# Altium schematic sheet Transmitter.SchDoc: Transmitter
size A4; Author: Andreas Rehn; CompanyName: Hochschule Ulm; Engineer: Andreas Rehn; Organization: Hochschule Ulm; Address1: Institut für Medizintechnik; Address2: und Mechatronik; Address3: Albert-Einstein-Allee 55; Address4: 89081 Ulm; SheetNumber: 6; SheetTotal: 11; ProjectName: Ultrasound Doppler 2015
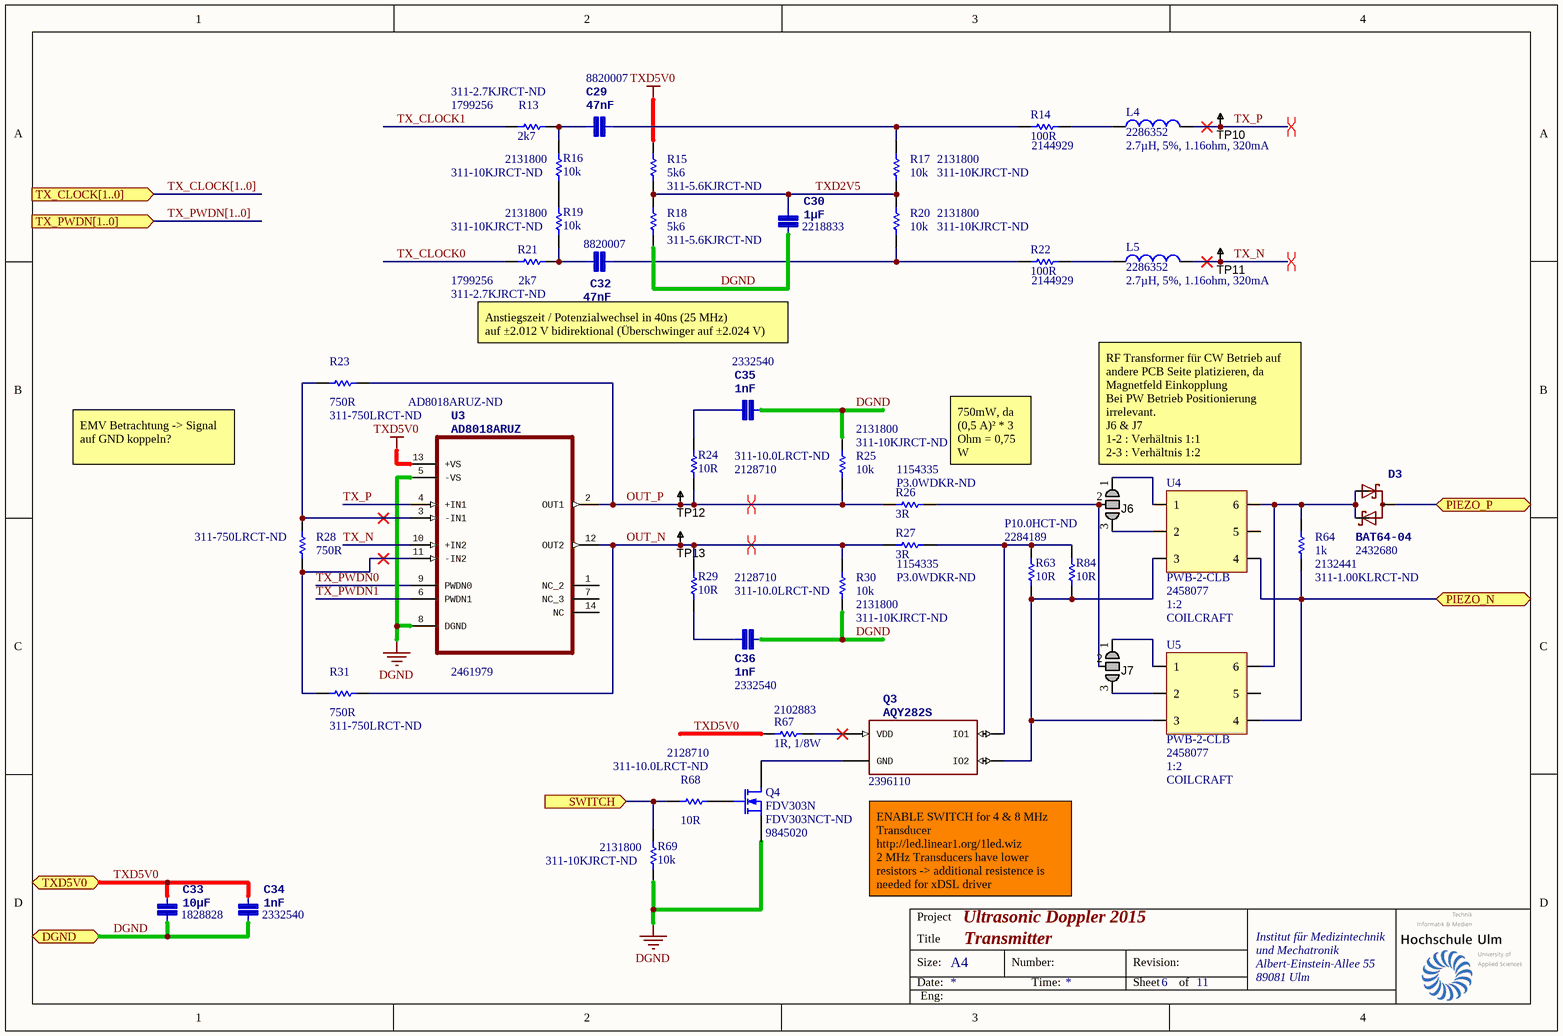
[diagram p0: Transmitter.SchDoc]

## Parts
C29  47nF  Supplier Part Number 1: 8820007  [0603[1508]]
C30  1µF  Supplier Part Number 1: 2218833  [0402[1005]]
C32  47nF  Supplier Part Number 1: 8820007  [0603[1508]]
C33  10µF  Supplier Part Number 1: 1828828  [0805[2012]]
C34  1nF  Supplier Part Number 1: 2332540  [0402[1005]]
C35  1nF  Supplier Part Number 1: 2332540  [0402[1005]]
C36  1nF  Supplier Part Number 1: 2332540  [0402[1005]]
D3  BAT64-04  Supplier Part Number 1: 2432680  [SOT23-3]
J6  Jumper  [Jump_3Way]  (value not drawn)  (no BOM)
J7  Jumper  [Jump_3Way]  (value not drawn)  (no BOM)
L4  2.7µH, 5%, 1.16ohm, 320mA  Supplier Part Number 1: 2286352  [WE0805]
L5  2.7µH, 5%, 1.16ohm, 320mA  Supplier Part Number 1: 2286352  [WE0805]
Q3  AQY282S  Supplier Part Number 1: 2396110  [SOP4]
Q4  FDV303N  Supplier Part Number 1: FDV303NCT-ND  Supplier Part Number 2: 9845020  [SOT23127P600-8N]
R13  2k7  Supplier Part Number 1: 311-2.7KJRCT-ND  Supplier Part Number 2: 1799256  [0402[1005]]
R14  100R  Supplier Part Number 1: 2144929  [0402[1005]]
R15  5k6  Supplier Part Number 1: 311-5.6KJRCT-ND  [0402[1005]]
R16  10k  Supplier Part Number 1: 311-10KJRCT-ND  Supplier Part Number 2: 2131800  [0402[1005]]
R17  10k  Supplier Part Number 1: 311-10KJRCT-ND  Supplier Part Number 2: 2131800  [0402[1005]]
R18  5k6  Supplier Part Number 1: 311-5.6KJRCT-ND  [0402[1005]]
R19  10k  Supplier Part Number 1: 311-10KJRCT-ND  Supplier Part Number 2: 2131800  [0402[1005]]
R20  10k  Supplier Part Number 1: 311-10KJRCT-ND  Supplier Part Number 2: 2131800  [0402[1005]]
R21  2k7  Supplier Part Number 1: 311-2.7KJRCT-ND  Supplier Part Number 2: 1799256  [0402[1005]]
R22  100R  Supplier Part Number 1: 2144929  [0402[1005]]
R23  750R  Supplier Part Number 1: 311-750LRCT-ND  [0402[1005]]
R24  10R  Supplier Part Number 1: 311-10.0LRCT-ND  Supplier Part Number 2: 2128710  [0402[1005]]
R25  10k  Supplier Part Number 1: 311-10KJRCT-ND  Supplier Part Number 2: 2131800  [0402[1005]]
R26  3R  Supplier Part Number 1: P3.0WDKR-ND  Supplier Part Number 2: 1154335  [2010[5.0x2.5 metric]]
R27  3R  Supplier Part Number 1: P3.0WDKR-ND  Supplier Part Number 2: 1154335  [2010[5.0x2.5 metric]]
R28  750R  Supplier Part Number 1: 311-750LRCT-ND  [0402[1005]]
R29  10R  Supplier Part Number 1: 311-10.0LRCT-ND  Supplier Part Number 2: 2128710  [0402[1005]]
R30  10k  Supplier Part Number 1: 311-10KJRCT-ND  Supplier Part Number 2: 2131800  [0402[1005]]
R31  750R  Supplier Part Number 1: 311-750LRCT-ND  [0402[1005]]
R63  10R  Supplier Part Number 1: 2284189  Supplier Part Number 2: P10.0HCT-ND  [0603[1508]]
R64  1k  Supplier Part Number 1: 311-1.00KLRCT-ND  Supplier Part Number 2: 2132441  [0402[1005]]
R67  1R, 1/8W  Supplier Part Number 1: 2102883  [RES1405[3614 Metric]]
R68  10R  Supplier Part Number 1: 311-10.0LRCT-ND  Supplier Part Number 2: 2128710  [0402[1005]]
R69  10k  Supplier Part Number 1: 311-10KJRCT-ND  Supplier Part Number 2: 2131800  [0402[1005]]
R84  10R  [0603[1508]]
TP10  TESTPOINT_THT_MINI  [TP-THT-MINI]  (value not drawn)
TP11  TESTPOINT_THT_MINI  [TP-THT-MINI]  (value not drawn)
TP12  TESTPOINT_THT_MINI  [TP-THT-MINI]  (value not drawn)
TP13  TESTPOINT_THT_MINI  [TP-THT-MINI]  (value not drawn)
U3  AD8018ARUZ  Supplier Part Number 1: 2461979  Supplier Part Number 2: AD8018ARUZ-ND  [TSSOP14]
U4  PWB-2-CLB  Supplier Part Number 1: 2458077  Impedance ratio: 1:2  Manufactor: COILCRAFT  [PWB-X-]
U5  PWB-2-CLB  Supplier Part Number 1: 2458077  Impedance ratio: 1:2  Manufactor: COILCRAFT  [PWB-X-]

## Ports
DGND, PIEZO_N, PIEZO_P, SWITCH (in), TX_CLOCK[1..0] (in), TX_PWDN[1..0] (in), TXD5V0

## Nets
DGND: C30.2(P$2) C33.2(P$2) C34.2(P$2) C35.1(P$1) C36.1(P$1) Q4.3(S) R18.2 R25.2 R30.2 R69.1 U3.5(-VS) U3.8(DGND) ; port DGND
TXD5V0: C33.1(P$1) C34.1(P$1) R15.1 R67.1 U3.13(+VS) ; port TXD5V0
OUT_N: R27.1 R29.1 R30.1 R31.2 TP13.1 U3.12(OUT2)
OUT_P: R23.2 R24.2 R25.1 R26.1 TP12.1 U3.2(OUT1)
PIEZO_N: R64.2 U4.4 U5.4 ; port PIEZO_N
PIEZO_P: D3.3(C1A2) ; port PIEZO_P
SWITCH: R68.1 R69.2 ; port SWITCH
TX_CLOCK0: R21.1
TX_CLOCK1: R13.1
TX_N: L5.2 TP11.1 U3.10(+IN2)
TX_P: L4.2 TP10.1 U3.4(+IN1)
TX_PWDN0: U3.9(PWDN0)
TX_PWDN1: U3.6(PWDN1)
TXD2V5: C30.1(P$1) R15.2 R17.2 R18.1 R20.1
NetC29_1: C29.1(P$1) R14.1 R17.1
NetC29_2: C29.2(P$2) R13.2 R16.1
NetC32_1: C32.1(P$1) R20.2 R22.1
NetC32_2: C32.2(P$2) R19.2 R21.2
NetC35_2: C35.2(P$2) R24.1
NetC36_2: C36.2(P$2) R29.2
NetD3_1: D3.1(A1) D3.2(C2) R64.1 U4.6 U5.6
NetJ6_1: J6.1 U4.1
NetJ6_2: J6.2 J7.2 R26.2
NetJ6_3: J6.3 U4.2
NetJ7_1: J7.1 U5.1
NetJ7_3: J7.3 U5.2
NetL4_1: L4.1 R14.2
NetL5_1: L5.1 R22.2
NetQ3_1: Q3.1(VDD) R67.2
NetQ3_2: Q3.2(GND) Q4.1(D)
NetQ3_3: Q3.3(IO2) R63.1 R84.1 U4.3 U5.3
NetQ3_4: Q3.4(IO1) R27.2 R63.2 R84.2
NetQ4_2: Q4.2(G) R68.2
NetR16_2: R16.2 R19.1
NetR23_1: R23.1 R28.1 U3.3(-IN1)
NetR28_2: R28.2 R31.1 U3.11(-IN2)

Not connected (* = marked no-connect by the designer): U3 1(NC_2) 7(NC_3) 14(NC); U4 5; U5 5

## Buses and harness runs
bus TX_CLOCK[1..0] = port TX_CLOCK[1..0]
bus TX_PWDN[1..0] = port TX_PWDN[1..0]

## Layout directives
differential pair: OUT_N, OUT_P, TX_N, TX_P

## Notes on the sheet
- Anstiegszeit / Potenzialwechsel in 40ns (25 MHz)
  auf ±2.012 V bidirektional (Überschwinger auf ±2.024 V)
- EMV Betrachtung -> Signal auf GND koppeln?
- (near R26) 750mW, da (0,5 A)² * 3 Ohm = 0,75 W
- RF Transformer für CW Betrieb auf andere PCB Seite platizieren, da Magnetfeld Einkopplung
  Bei PW Betrieb Positionierung irrelevant.
  J6 & J7
  1-2 : Verhältnis 1:1
  2-3 : Verhältnis 1:2
- (near Q3) ENABLE SWITCH for 4 & 8 MHz Transducer
  http://led.linear1.org/1led.wiz
  2 MHz Transducers have lower resistors -> additional resistence is needed for xDSL driver
- Project
- Ultrasonic Doppler 2015
- Title
- Size:
- Date:
- A4
- Number:
- Time:
- Revision:
- Sheet
- of
- Eng:

## Library data of the parts
C29 C30 C32-C36 = Capacitor: Cap; Supplier 1: Farnell
  C29 C32: value: 47nF
  C30: value: 1µF
  C33: value: 10µF
  C34-C36: value: 1nF
D3 = BAT64-04: Silicon Schottky Diodes; value: BAT64-04; Supplier 1: Farnell
J6 J7 = JUMP_3WAY: SMD jumper
L4 L5 = Inductor: Ferrit; Code_IEC: 1005; Published: 8-Jun-2000; LatestRevisionDate: 29-May-2009; LatestRevisionNote: IPC-7351 Footprint Added.; PackageReference: 0402-A; Publisher: Altium Limited; PackageDescription: Chip Inductor; Code_JEITA: 0402; Value: 2.7µH, 5%, 1.16ohm, 320mA; Supplier 1: Farnell
Q3 = AQY282S: PhotoMOS RELAY 0.5A, 60V; value: AQY282S; ComponentLink1URL: http://www.farnell.com/datasheets/1486501.pdf; Supplier 1: Farnell; ComponentLink1Description: Datasheet
Q4 = MOSFET-N: N-Channel MOSFET; Published: 8-Jun-2000; LatestRevisionDate: 17-Jul-2002; LatestRevisionNote: Re-released for DXP Platform.; PackageVersion: 1995/1996; PackageReference: E3; Publisher: Altium Limited; PackageDescription: TO, Flat Index; 3 In-Line, Axial Leads; Body Dia. 4.6mm; Lead Dia. 0.5 mm (max); Supplier 1: Digi-Key; Supplier 2: Farnell; value: FDV303N; ComponentLink1URL: https://www.fairchildsemi.com/datasheets/FD/FDV303N.pdf; ComponentLink1Description: DataSheet
R13-R31 R63 R64 R67-R69 R84 = Resistor: Published: 8-Jun-2000; LatestRevisionDate: 17-Jul-2002; LatestRevisionNote: Re-released for DXP Platform.; Publisher: Altium Limited; PackageDescription: Axial Device, Thru-Hole; 2 Leads; 0.3 in Pin Spacing
  R13 R21: PackageReference: AXIAL-0.3; Value: 2k7; Supplier 1: Digi-Key; Supplier 2: Farnell
  R14 R22: Value: 100R; Supplier 1: Farnell
  R15 R18: PackageReference: AXIAL-0.3; Value: 5k6; Supplier 1: Digi-Key
  R16 R17 R19 R20 R69: Value: 10k; Supplier 1: Digi-Key; Supplier 2: Farnell
  R23 R28 R31: PackageReference: AXIAL-0.3; Value: 750R; Supplier 1: Digi-Key
  R24 R29: PackageReference: AXIAL-0.3; Value: 10R; Supplier 1: Digi-Key; Supplier 2: Farnell
  R25 R30: PackageReference: AXIAL-0.3; Value: 10k; Supplier 1: Digi-Key; Supplier 2: Farnell
  R26 R27: PackageReference: AXIAL-0.3; Value: 3R; Supplier 1: Digi-Key; Supplier 2: Farnell
  R63: PackageReference: AXIAL-0.3; Value: 10R; Supplier 1: Farnell; Supplier 2: Digi-Key
  R64: PackageReference: AXIAL-0.3; Value: 1k; Supplier 1: Digi-Key; Supplier 2: Farnell
  R67: Value: 1R, 1/8W; Supplier 1: Farnell
  R68: Value: 10R; Supplier 1: Digi-Key; Supplier 2: Farnell
  R84: PackageReference: AXIAL-0.3; Value: 10R; Supplier 1: Farnell; Supplier Part Number 1: 2284189; Supplier 2: Digi-Key; Supplier Part Number 2: P10.0HCT-ND
TP10-TP13 = TESTPOINT_THT_MINI: Test Point PCB mount Miniature White; PBL Part Number: 3100-567; Manufacturer 1: Keystone Electronics; Manufacturer Part Number 1: 5002; Mounting Type: 0.040" (1.0mm) Hole Diameter; Material: Base, Nylon 46, UL 94V-0; Supplier 1: Digi-Key; Supplier Part Number 1: 5002K-ND
U3 = AD8018ARUZ: XDSL - IC, OP-AMP, 130MHz, 300V/ us, 1mV; MPN: AD8018ARUZ; OC_FARNELL: 1899407; OC_NEWARK: 59K6188; PACKAGE: TSSOP-14; SUPPLIER: Analog Devices; ComponentLink1URL: http://www.farnell.com/datasheets/101665.pdf; value: AD8018ARUZ; ComponentLink1Description: Datasheet; Supplier 1: Farnell; Supplier 2: Digi-Key
U4 U5 = RF Transformer: Idc: 250mA; Supplier 1: Farnell; value: PWB-2-CLB; ComponentLink1URL: http://www.farnell.com/datasheets/1870435.pdf; ComponentLink1Description: DataSheet